# Altium schematic sheet IMU.SchDoc
size A4; SheetNumber: 4; SheetTotal: 6
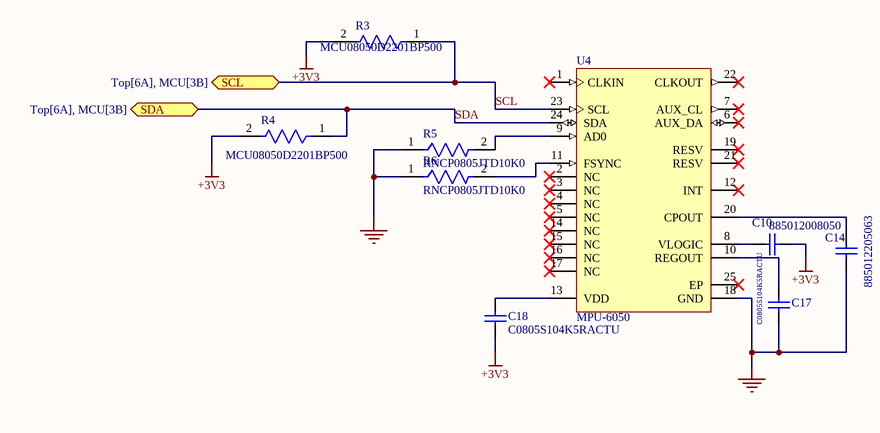
[diagram p0: IMU.SchDoc]

## Parts
C10  885012008050  [WCAP-CSGP_1206_L3.2W1.6H0.8]
C14  885012205063  [WCAP-CSGP_0402_L1W0.5H0.5]
C17  C0805S104K5RACTU  [CAPC2013X145X50NL20T25]
C18  C0805S104K5RACTU  [CAPC2013X145X50NL20T25]
R3  MCU08050D2201BP500  [FP-MCU0805-MFG]
R4  MCU08050D2201BP500  [FP-MCU0805-MFG]
R5  RNCP0805JTD10K0  [FP-RNCP0805-IPC_B]
R6  RNCP0805JTD10K0  [FP-RNCP0805-IPC_B]
U4  MPU-6050  [IS-QFN-24_V]

## Ports
SCL (bidir, see Top[6A], MCU[3B]), SDA (bidir, see Top[6A], MCU[3B])

## Nets
+3V3: C10.2 C18.1 R3.2 R4.2
NetC14_1: C14.1 C17.1 R5.1 R6.1 U4.18(GND)
SCL: R3.1 U4.23(SCL) ; port SCL
SDA: R4.1 U4.24(SDA) ; port SDA
NetC10_1: C10.1 U4.8(VLOGIC)
NetC14_2: C14.2 U4.20(CPOUT)
NetC17_2: C17.2 U4.10(REGOUT)
NetC18_2: C18.2 U4.13(VDD)
NetR5_2: R5.2 U4.9(AD0)
NetR6_2: R6.2 U4.11(FSYNC)

Not connected (* = marked no-connect by the designer): U4 1(CLKIN)* 2(NC)* 3(NC)* 4(NC)* 5(NC)* 6(AUX_DA)* 7(AUX_CL)* 12(INT)* 14(NC)* 15(NC)* 16(NC)* 17(NC)* 19(RESV)* 21(RESV)* 22(CLKOUT)* 25(EP)*

## Library data of the parts
C10 = CMP-03913-65419687-2: WCAP-CSGP 1206 (3216Metric) Ceramic Capacitor 0.126Lx0.063W 3.20mmx1.60mm C0G NP0 ±5% 1500pF; Capacitance: 1.5nF; Voltage Rating: 50V; Insulation Resistance: 10GΩ; Tolerance: 5%; Case Code (Metric): 3216; Length: 3.2mm; Mount: Surface Mount; Width: 1.6mm; Max Operating Temperature: 125°C; Min Operating Temperature: -55°C; RoHS: Compliant; Case/Package: 1206; Case Code (Imperial): 1206; Height: 800µm; Thickness: 889µm
C14 = CMP-03913-53703200-2: Cap Ceramic 0.0022uF 50V X7R 10% Pad SMD 0402 125C T/R; Insulation Resistance: 10GΩ; Capacitance: 2.2nF; Length: 1mm; Packaging: Tape & Reel (TR); Thickness: 558.8µm; Max Operating Temperature: 125°C; Tolerance: 10%; Case/Package: 0402; Case Code (Metric): 1005; Mount: Surface Mount; RoHS: Compliant; Voltage Rating: 50V; Height: 500µm; Case Code (Imperial): 0402; Min Operating Temperature: -55°C; Width: 500µm
C17 C18 = CMP-2007-01227-1: Manufacturer: Kemet; Part Number: C0805S104K5RACTU
R3 R4 = CMP-02407-001865-1: RES 1.05K OHM 0.5% 1/5W 0805; Resistance: 2.2kR; Tolerance: 0.1%; Temperature Coefficient: 25ppm/°C; Max Power Dissipation: 125mW; Package Quantity: 5000; Packaging: Tape and Reel; Min Operating Temperature: -55°C; Military Standard: Not; Number of Terminations: 2; Max Operating Temperature: 125°C; Height: 0.022inch; Depth: 1.25mm; Composition: Thin Film; Width: 0.049inch; Case/Package: 0805; Length: 0.079inch; Lead Free: Lead Free
R5 R6 = CMP-26527-002868-1: 10kΩ ±5% 0.25W 0805 High Power Anti-Sulfur Thin Film Chip Resistor; Max Operating Temperature: 155°C; Min Operating Temperature: -55°C; Mount: Surface Mount; Tolerance: 5%; RoHS Compliant: Yes
U4 = CMP-1753-00002-2: 3-Axis Gyroscope, Accelerometer and a Digital Motion Processor(TM) (DMP), 2.375 to 3.46 V, -40 to 85 degC, 24-Pin QFN, RoHS, Tape and Reel; Manufacturer: InvenSense; Featured Product: MPU-60506-Axis,IntegratedI²CSolution; Other Names: 1428-1007-2 / MPU6050; Sensor Type: MotionTracking; Online Catalog: MPU-6000™Series; Unit PriceUSD: Digital; Datasheet Version: Rev. 3.3, 05/2012; Category: Sensors,Transducers; Datasheet URL: http://datasheet.octopart.com/MPU-6050-InvenSense-datasheet-14421344.pdf; Family: Multifunction; Standard Package: 5,000; Manufacturer URL: http://www.invensense.com/; Output Type: Digital; Dynamic Catalog: MPU-6000™Series